# EAGLE design flight (EAGLE 7.4.0)
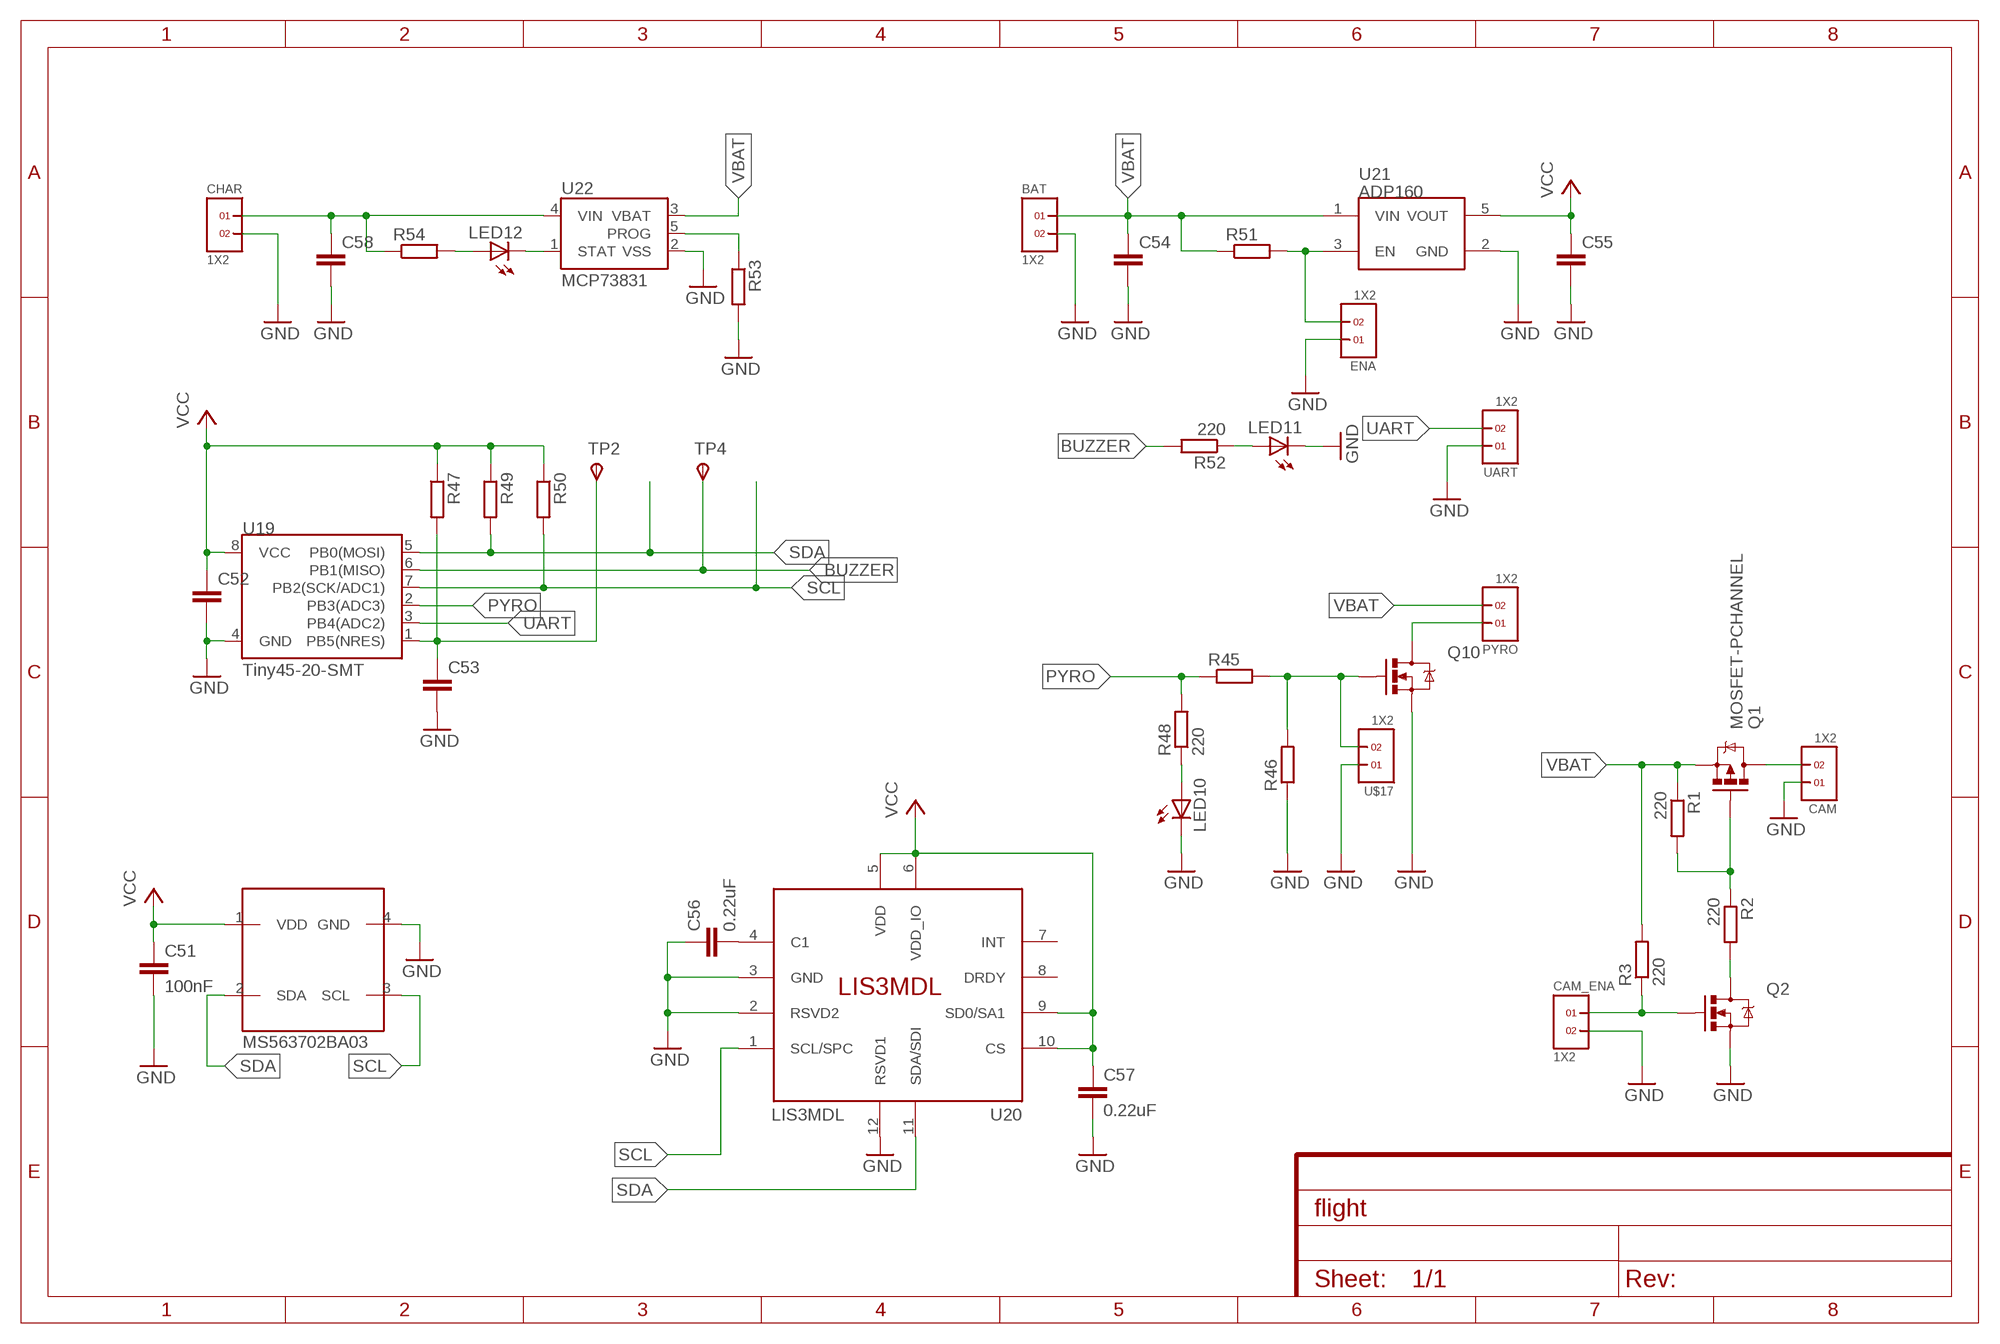
[diagram p0: schematic, sheet 1]

## Parts
BAT  1X2  [1X2]
C51  100nF  C-EUC0603  [C0603]
C52  C-EUC1206  [C1206]
C53  C-EUC0603  [C0603]
C54  C-EUC0603  [C0603]
C55  C-EUC0603  [C0603]
C56  0.22uF  C-EUC0603K  [C0603K]
C57  0.22uF  C-EUC0603  [C0603]
C58  C-EUC0603  [C0603]
CAM  1X2  [1X2]
CAM_ENA  1X2  [1X2]
CHAR  1X2  [1X2]
ENA  1X2  [1X2]
IC2  MS563702BA03  [MS5637]
LED10  LEDCHIPLED_0805  [CHIPLED_0805]
LED11  LEDCHIPLED_0805  [CHIPLED_0805]
LED12  LEDCHIPLED_0603  [CHIPLED_0603]
PYRO  1X2  [1X2]
Q1  MOSFET-PCHANNEL  [SOT23-3]
Q2  MOSFET-NCHANNELBSS123LT1G  [SOT23-3]
Q10  MOSFET-NCHANNELBSS123LT1G  [SOT23-3]
R1  220  R-EU_R0603  [R0603]
R2  220  R-EU_R0603  [R0603]
R3  220  R-EU_R0603  [R0603]
R45  R-EU_R0603  [R0603]
R46  R-EU_R0603  [R0603]
R47  R-EU_R0603  [R0603]
R48  220  R-EU_R0603  [R0603]
R49  R-EU_R0603  [R0603]
R50  R-EU_R0603  [R0603]
R51  R-EU_R0603  [R0603]
R52  220  R-EU_R0603  [R0603]
R53  R-EU_R0603  [R0603]
R54  R-EU_R0603  [R0603]
TP2  TPSB1,27  [B1,27]
TP4  TPSB1,27  [B1,27]
U19  Tiny45-20-SMT  ATTINY45TINY45-20-SMT  [SO08-EIAJ]
U20  LIS3MDL  [VFLGA-12]
U21  ADP160  [SOT23-5]
U22  MCP73831  [SOT23-5]
U$17  1X2  [1X2]
UART  1X2  [1X2]

## Nets
BUZZER: R52.2 TP4.TP(PP) U19.6(PB1(MISO))
ENA: ENA.2 R51.2 U21.3(EN)
GND: BAT.2 C51.2 C52.2 C53.2 C54.2 C55.2 C56.1 C57.2 C58.2 CAM.1 CAM_ENA.2 CHAR.2 ENA.1 IC2.4(GND) LED10.C LED11.C Q2.2(S) Q10.2(S) R46.1 R53.2 U19.4(GND) U20.2(RSVD2) U20.3(GND) U20.12(RSVD1) U21.2(GND) U22.2(VSS) U$17.1 UART.1
N$1: Q2.3(D) R2.2
N$2: CAM.2 Q1.3(D)
N$3: Q1.1(G) R1.2 R2.1
N$4: CAM_ENA.1 Q2.1(G) R3.1
N$132: C53.1 R47.2 TP2.TP(PP) U19.1(PB5(NRES))
N$133: Q10.1(G) R45.2 R46.2 U$17.2
N$134: LED10.A R48.1
N$135: C56.2 U20.4(C1)
N$137: LED11.A R52.1
N$138: PYRO.1 Q10.3(D)
N$139: R53.1 U22.5(PROG)
N$140: LED12.C U22.1(STAT)
N$141: LED12.A R54.2
N$142: C58.1 CHAR.1 R54.1 U22.4(VIN)
PYRO: R45.1 R48.2 U19.2(PB3(ADC3))
SCL: IC2.3(SCL) R50.2 U19.7(PB2(SCK/ADC1)) U20.1(SCL/SPC)
SDA: IC2.2(SDA) R49.2 U19.5(PB0(MOSI)) U20.11(SDA/SDI)
UART: U19.3(PB4(ADC2)) UART.2
VBAT: BAT.1 C54.1 PYRO.2 Q1.2(S) R1.1 R3.2 R51.1 U21.1(VIN) U22.3(VBAT)
VCC: C51.1 C52.1 C55.1 C57.1 IC2.1(VDD) R47.1 R49.1 R50.1 U19.8(VCC) U20.5(VDD) U20.6(VDD_IO) U20.9(SD0/SA1) U20.10(CS) U21.5(VOUT)
Unconnected: U20.7(INT) U20.8(DRDY)

## Library data of the parts
BAT CAM CAM_ENA CHAR ENA PYRO U$17 UART = headers(2mm)(samtec):1X2
C51-C58 = rcl:C-EU: CAPACITOR, European symbol
IC2 = freetronics-original:MS5637
LED10-LED12 = led:LED: LED OSRAM: - CHIPLED LG R971, LG N971, LY N971, LG Q971, LY Q971, LO R971, LY R971 LH N974, LH R974 LS Q976, LO Q976, LY Q976 LO Q996 - Hyper CHIPLED LW Q18S LB Q993, LB Q99A, LB R99A - SideLED LS A670, LO A670, LY A670, LG A670, LP A670 LB A673, LV A673, LT A673, LW A673 LH A674 LY A675 LS A676, LA A676, LO A676, LY A676, LW A676 LS A679, LY A679, LG A679 - Hyper Micro SIDELED® LS Y876, LA Y876, LO Y876, LY Y876 LT Y87S - SmartLED LW L88C, LW L88S LB L89C, LB L89S, LG L890 LS L89K, LO L89K, LY L89K LS L896, LA L896, LO L896, LY L896 - TOPLED LS T670, LO T670, LY T670, LG T670, LP T670 LSG T670, LSP T670, LSY T670, LOP T670, LYG T670 LG T671, LOG T671, LSG T671 LB T673, LV T673, LT T673, LW T673 LH T674 LS T676, LA T676, LO T676, LY T676, LB T676, LH T676, LSB T676, LW T676 LB T67C, LV T67C, LT T67C, LS T67K, LO T67K, LY T67K, LW E67C LS E67B, LA E67B, LO E67B, LY E67B, LB E67C, LV E67C, LT E67C LW T67C LS T679, LY T679, LG T679 LS T770, LO T770, LY T770, LG T770, LP T770 LB T773, LV T773, LT T773, LW T773 LH T774 LS E675, LA E675, LY E675, LS T675 LS T776, LA T776, LO T776, LY T776, LB T776 LHGB T686 LT T68C, LB T68C - Hyper Mini TOPLED® LB M676 - Mini TOPLED Santana® LG M470 LS M47K, LO M47K, LY M47K Source: http://www.osram.convergy.de LUXEON: - LUMILED® LXK2-PW12-R00, LXK2-PW12-S00, LXK2-PW14-U00, LXK2-PW14-V00 LXK2-PM12-R00, LXK2-PM12-S00, LXK2-PM14-U00 LXK2-PE12-Q00, LXK2-PE12-R00, LXK2-PE12-S00, LXK2-PE14-T00, LXK2-PE14-U00 LXK2-PB12-K00, LXK2-PB12-L00, LXK2-PB12-M00, LXK2-PB14-N00, LXK2-PB14-P00, LXK2-PB14-Q00 LXK2-PR12-L00, LXK2-PR12-M00, LXK2-PR14-Q00, LXK2-PR14-R00 LXK2-PD12-Q00, LXK2-PD12-R00, LXK2-PD12-S00 LXK2-PH12-R00, LXK2-PH12-S00 LXK2-PL12-P00, LXK2-PL12-Q00, LXK2-PL12-R00 Source: www.luxeon.com KINGBRIGHT: KA-3528ASYC Source: www.kingbright.com
Q1 = SparkFun-DiscreteSemi:MOSFET-PCHANNEL: Generic PMOSFET IRLML2244 - TRANS-11153 (SOT-23 -20V -4.3A) (1.Gate 2.Source 3.Drain) FQP27P06 - COM-10349 <http://www.sparkfun.com/products/10349> (TO-220 -60V -27A) (1.Gate 2.Source 3.Drain); PROD_ID: TRANS-08285
Q2 Q10 = SparkFun-DiscreteSemi:MOSFET-NCHANNEL: Common NMOSFET Parts MFG P/N Store ID Prod ID FDD8780 TRANS-09984 SI7820DN TRANS-11055 FDS6630A IC-08089 2N7002PW TRANS-11151 FQP30N06L COM-10213 TRANS-10060 BSS123LT1G TRANS-08345 BSS138 TRANS-00830 BS170 2N7000; PROD_ID: TRANS-08345
R1-R3 R48 R52 = resistor:R-EU_: RESISTOR, European symbol
R45-R47 R49-R51 R53 R54 = rcl:R-EU_: RESISTOR, European symbol
TP2 TP4 = testpad:TPS: TEST PIN
U19 = SparkFun-DigitalIC:ATTINY45: Atmel 8-pin 2/4/8kB flash uC; PROD_ID: IC-08922
U20 = kg-ic:LIS3MDL: Digital output magnetic sensor: ultra-low-power high-performance 3-axis magnetometer The LIS3MDL is an ultra-low-power high-performance three-axis Magnetic Sensor. It has user-selectable full scales of ±4/ ±8/ ±12/ ±16 gauss. The self-test capability allows the user to check the functioning of the sensor in the final application. The device may be configured to generate interrupt signals for magnetic field detection. It includes an I²C serial bus interface that supports standard and fast mode (100 and 400kHz) and SPI serial standard interface. Independent IO Supply (1.8V) ±4/±8/±12/±16 Gauss Selectable Magnetic Full Scale Continuous and Single-conversion Modes 16-bit Data Output Interrupt Generator Self-test I²C/SPI Digital Output Interface Power-down Mode/Low-power Mode
U21 = SparkFun-PowerIC:ADP160: Nanopower LDO Iq less than 1uA for low Iload; FARNELL: 2510377; PROD_ID: VREG-11306
U22 = SparkFun-PowerIC:MCP73831: Miniature single cell, fully integrated Li-Ion, Li-polymer charge management controller http://ww1.microchip.com/downloads/en/DeviceDoc/20001984g.pdf IC-09995; FARNELL: 1834892; PROD_ID: IC-09995

## Board
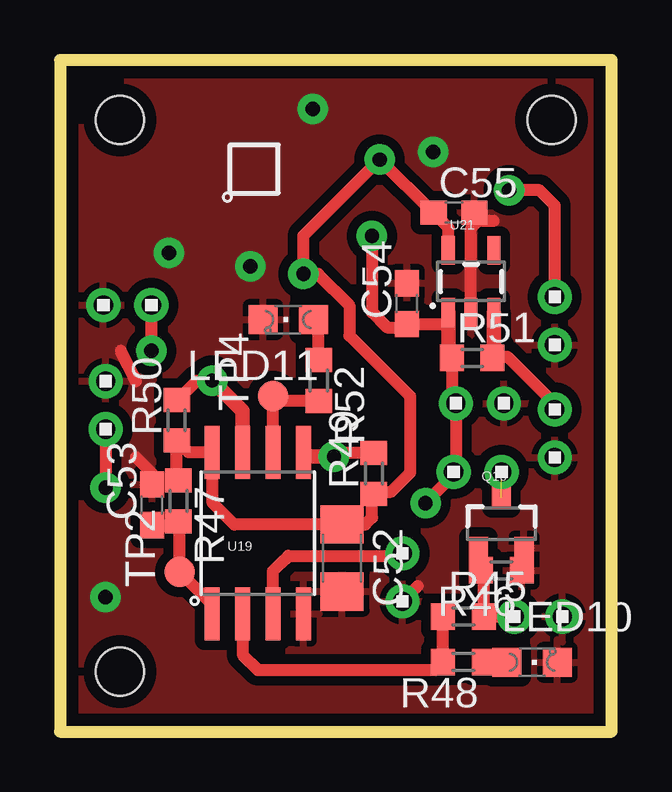
[diagram p1: board, top side]
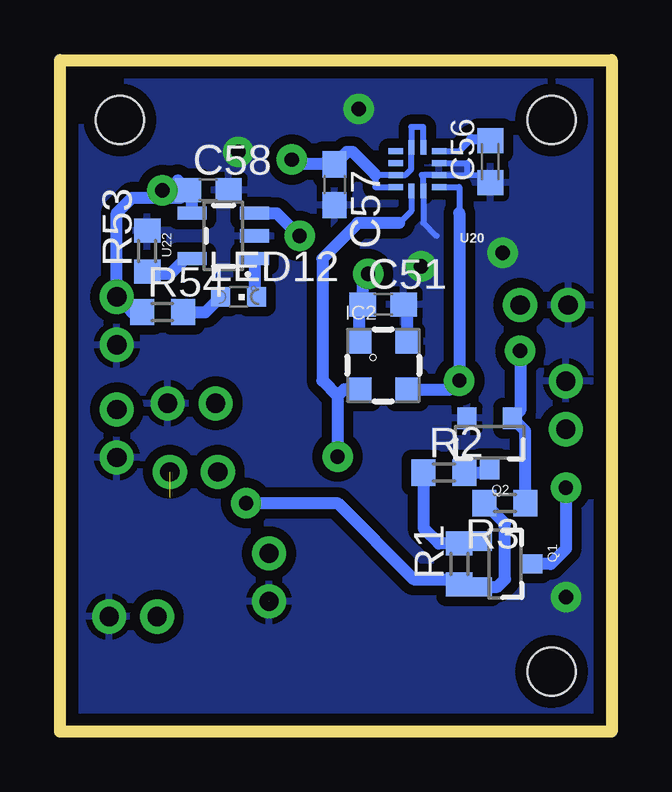
[diagram p2: board, bottom side, seen from below]

Size 23 x 28 mm. Coordinates in mm from the lower left corner, seen from the top.
Outline: 0,0 23,0 23,28 0,28 0,0
Copper layers (1*16): Top 0.035mm / dielectric 1.5mm / Bottom 0.035mm
Design rules "default *": minimum track width 10mil, minimum drill 24mil, track to track 8mil, track to pad 8mil, pad to pad 8mil, via to via 8mil, smd to smd 8mil, copper to edge 20mil, drill to drill 8mil, minimum pad ring 10mil, minimum via ring 8mil, stop-mask expansion 4mil, vias tented up to drill 0mil, thermal gap 10mil
Holes 2 mm at 2.5,2.5 2.5,25.5 20.5,25.5
bRestrict: area 8.3,14 to 10.8,16.5

### Footprints (pad centres in the part's own frame; a part is rotated, then mirrored left to right if it is on the bottom)
1X2 = drill 0.8 pad 1.422: 1 0,0; 2 2,0
C0603 = smd 1.1 x 1: 1 -0.85,0; 2 0.85,0
C1206 = smd 1.6 x 1.8: 1 -1.4,0; 2 1.4,0
C0603K = smd 1.05 x 1.08: 1 -0.875,0; 2 0.875,0
MS5637 = smd 1 x 1: 1 -1,1; 2 -1,-1; 3 1,-1; 4 1,1
CHIPLED_0805 = smd 1.2 x 1.2: A 0,-1.05; C 0,1.05
CHIPLED_0603 = smd 0.8 x 0.8: A 0,-0.75; C 0,0.75
SOT23-3 = smd 0.8 x 0.9: 1 -0.95,-1; 2 0.95,-1; 3 0,1.1
R0603 = smd 1 x 1.1: 1 -0.85,0; 2 0.85,0
B1,27 = smd 1.27 x 1.27: TP 0,0
SO08-EIAJ = smd 0.61 x 2.21: 1 -1.905,-3.378; 2 -0.635,-3.378; 3 0.635,-3.378; 4 1.905,-3.378; 5 1.905,3.353; 6 0.635,3.353; 7 -0.635,3.353; 8 -1.905,3.353
VFLGA-12 = smd 0.6 x 0.25: 1 -0.9,0.75; 2 -0.9,0.25; 3 -0.9,-0.25; 4 -0.9,-0.75; 7 0.9,-0.75; 8 0.9,-0.25; 9 0.9,0.25; 10 0.9,0.75 | smd 0.25 x 0.6: 5 -0.25,-0.9; 6 0.25,-0.9; 11 0.25,0.9; 12 -0.25,0.9
SOT23-5 = smd 0.55 x 1.2: 1 -0.95,-1.3; 2 0,-1.3; 3 0.95,-1.3; 4 0.95,1.3; 5 -0.95,1.3

### Placement (x,y rotation side)
BAT  16.51,13.68 0 top
C51  9.52,17.81 0 bottom
C52  11.76,7.23 270 top
C53  3.84,9.45 90 top
C54  14.47,17.84 90 top
C55  16.43,21.63 0 top
C56  5.06,23.76 90 bottom
C57  11.55,22.8 270 bottom
C58  16.82,22.57 0 bottom
CAM  1.91,14.61 270 top
CAM_ENA  3.81,17.78 180 top
CHAR  20.63,18.12 270 top
ENA  20.63,11.43 90 top
IC2  9.52,15.27 0 bottom
LED10  19.68,2.89 270 top
LED11  9.52,17.17 90 top
LED12  15.55,18.12 270 bottom
PYRO  18.41,10.83 180 top
Q1  4.45,6.99 270 bottom
Q2  5.08,12.06 180 bottom
Q10  18.4,8.67 0 top
R1  6.35,6.99 90 bottom
R2  6.99,10.79 0 bottom
R3  4.45,9.53 180 bottom
R45  16.83,4.79 0 top
R46  18.4,6.72 180 top
R47  4.94,9.62 270 top
R48  16.82,2.9 180 top
R49  13.09,10.76 90 top
R50  4.87,12.98 90 top
R51  17.19,15.58 0 top
R52  10.79,14.63 270 top
R53  19.36,20.03 90 bottom
R54  18.72,17.49 0 bottom
TP2  5,6.65 90 top
TP4  8.89,14 90 top
U19  8.25,8.28 0 top
U20  8.1,23.45 180 bottom
U21  17.14,18.76 0 top
U22  16.18,20.66 90 bottom
U$17  20.95,4.79 180 top
UART  14.28,5.43 90 top

### Tracks (layer width: path | path; a pad name or v marks a point on that pad's centre or on a via)
BUZZER
  Top 0.5: U19.6 TP4.TP 9.1,13.78 R52.2
ENA
  Top 0.5: 18.09,15.63 18.66,15.63 20.32,13.97 20.32,13.74 ENA.2
  Top 0.61: U21.3 18.09,15.63 R51.2
GND  (via drill 0.6 pad 1.27)  (1 unrouted)
  Top 0.5: UART.1 14.91,6.06 | U21.2 17.14,20.99 17.45,21.3 17.61,21.3 | 17.61,21.3 C55.2 | 17.61,21.3 18.09,21.3 | 3.17,14.61 2.54,15.88 | C53.2 3.84,10.77 3.17,11.43
  Bottom 0.25: 5.37,23.2 C56.1 | U20.3 6.02,23.7 6.02,23.2 | 6.02,23.2 U20.2 7.92,23.2 7.84,23.12 U20.12 7.84,21.21 7.29,20.66 | 6.02,23.2 5.39,23.2
  Bottom 0.5: IC2.4 8.52,17.66 C51.2
  other vias: 4.54,19.95 7.93,19.4 15.56,24.16 10.54,25.95 1.9,5.6
  pour Top (isolate 0.406): -0.32,28.57 24.21,28.57 24.21,-0.34 -0.32,-0.34
  pour Bottom (isolate 0.406): 0,-0.29 24.44,-0.6 24.44,28.61 0,28.29
N$1
  Bottom 0.5: R2.2 5.25,10.79 Q2.3
N$2  (via drill 0.6 pad 1.27)
  Top 0.5: CAM.2 v1.91,10.16
  Bottom 0.5: v1.91,10.16 1.91,7.62 2.54,6.99 Q1.3
N$3
  Bottom 0.5: Q1.1 6.25,7.93 R1.2 7.2,7.83 7.83,8.47 R2.1
N$4  (via drill 0.6 pad 1.27)
  Top 0.5: CAM_ENA.1 v3.81,15.88
  Bottom 0.5: v3.81,15.88 3.81,13.38 Q2.1 3.6,12.53 R3.1
N$132
  Top 0.5: C53.1 4.94,8.6 R47.2 5,8.71 TP2.TP 6.34,5.3 U19.1
N$133
  Top 0.5: U$17.2 R45.2 17.68,6.6 R46.2
  Top 0.61: Q10.1 17.45,6.82 R46.2
N$134
  Top 0.5: R48.1 LED10.A
N$135
  Bottom 0.25: U20.4 6.34,24.2 5.84,24.7
  Bottom 0.406: 5.84,24.7 5.12,24.7 C56.2
N$137
  Top 0.5: LED11.A 10.79,16.95 R52.1
N$138  (1 unrouted)
N$139
  Bottom 0.5: U22.5 17.77,19.71 18.41,19.08 19.26,19.08 R53.1
N$140
  Bottom 0.5: U22.1 14.88,18.21 LED12.C
N$141
  Bottom 0.5: R54.2 16.93,17.49 LED12.A
N$142  (via drill 0.6 pad 1.27)
  Top 0.5: CHAR.1 20.63,21.93 19.99,22.57 v18.72,22.57
  Bottom 0.5: U22.4 17.48,22.38 C58.1 | R54.1 19.99,17.49 CHAR.1 20.63,21.62 19.99,22.25 17.99,22.25 C58.1 | 18.09,22.99 C58.1
PYRO
  Top 0.5: 15.87,2.8 R48.2 | R48.2 R45.1 | U19.2 7.62,3.21 8.25,2.57 15.64,2.57 R48.2
SCL  (via drill 0.6 pad 1.27)
  Top 0.5: R50.2 4.91,13.83 5.71,14.63 v6.34,14.63
  Top 0.61: U19.7 7.62,13.36 v6.34,14.63
  Bottom 0.25: U20.1 6.34,22.7 6.34,21.62
  Bottom 0.5: IC2.3 6.71,14.27 v6.34,14.63 6.34,21.62
SDA  (via drill 0.6 pad 1.27)
  Top 0.3: 10.26,11.46 U19.5
  Top 0.5: R49.2 11.57,11.61 v11.43,11.46
  Top 0.61: 10.26,11.46 v11.43,11.46
  Bottom 0.25: U20.11 8.35,21.7 8.85,21.2
  Bottom 0.5: IC2.2 11.15,14.27 11.43,14 | 11.43,14 v11.43,11.46 | 8.85,21.2 10.57,21.2 12.06,19.71 12.06,14.63 11.43,14
UART
  Top 0.5: U19.3 8.88,6.7 9.2,7.02 | 9.2,7.02 | 9.2,7.02 9.52,7.33 13.87,7.33 UART.2
VBAT  (via drill 0.6 pad 1.27)
  Top 0.5: R51.1 16.34,13.85 BAT.1 16.51,10.92 PYRO.2 16.41,10.7 v15.24,9.53 | 16.19,16.86 16.06,16.99 C54.1 14.33,16.85 13.64,16.85 13.01,17.49 v13.01,20.66
  Top 0.61: U21.1 16.19,16.86 16.19,15.72 R51.1
  Bottom 0.5: U22.3 13.96,21.61 v13.01,20.66 | R3.2 4.45,8.68 4.45,6.35 4.76,6.04 Q1.2 6.25,6.04 R1.1 6.57,6.35 8.26,6.35 11.43,9.53 v15.24,9.53
VCC  (via drill 0.6 pad 1.27)
  Top 0.5: U21.5 16.19,20.97 16.21,20.99 C55.1 15.55,21.63 v13.33,23.84 10.15,20.67 v10.15,19.08 10.77,19.08 12.06,17.78 12.06,16.51 14.61,13.97 14.61,10.79 13.81,10 13.18,10 R49.1 13.02,9.84 13.02,8.92 12.73,8.63 C52.1 7.26,8.63 6.34,9.55 U19.8 5.36,11.64 R50.1 4.87,10.47 R47.1
  Bottom 0.25: U20.5 7.84,25.2 8.35,25.2 U20.6 8.35,23.45 8.6,23.2 U20.9 9.85,23.2 9.85,22.7 U20.10
  Bottom 0.5: IC2.1 10.52,17.66 C51.1 10.37,18.86 v10.15,19.08 | 9.85,23.2 9.85,23.21 10.79,24.16 11.04,24.16 C57.1 13.13,23.65 v13.33,23.84

### Text on the board
tRestrict: T
bRestrict: B